# EasyEDA Pro project TRV-Controller.epro, board TRVC_v1.1
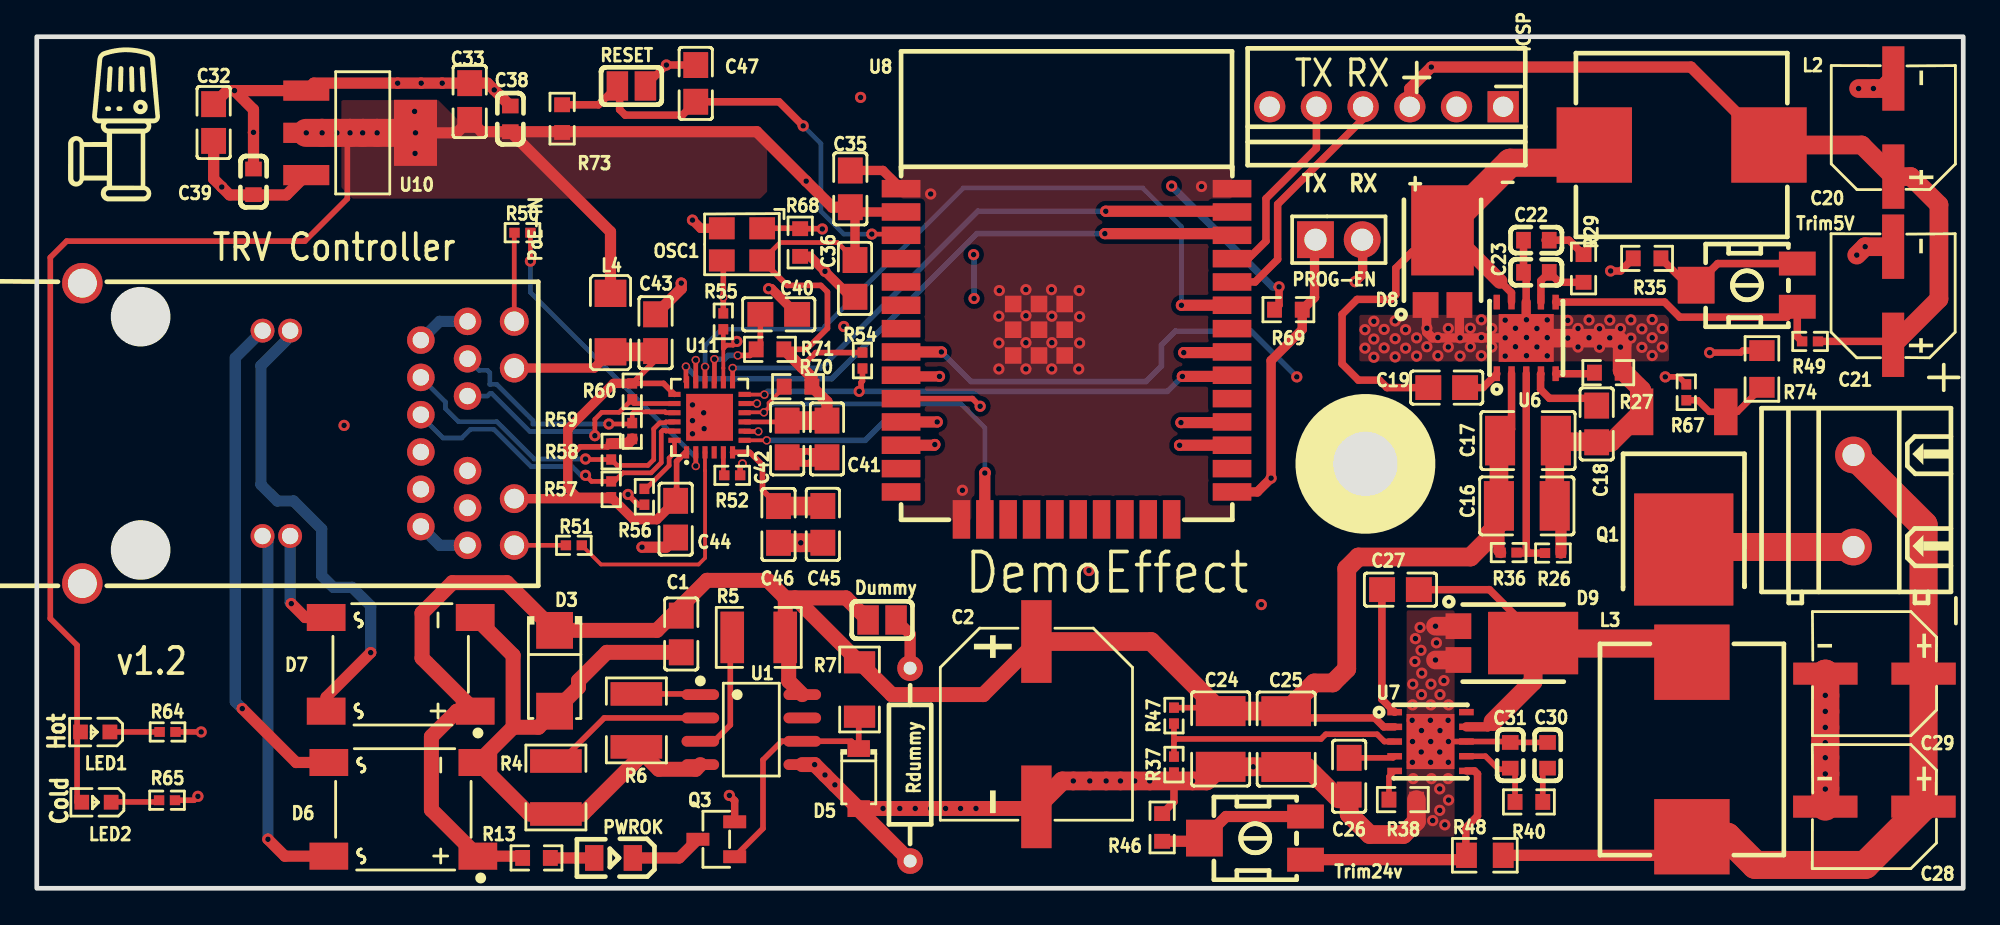
[diagram p3: board, top side]
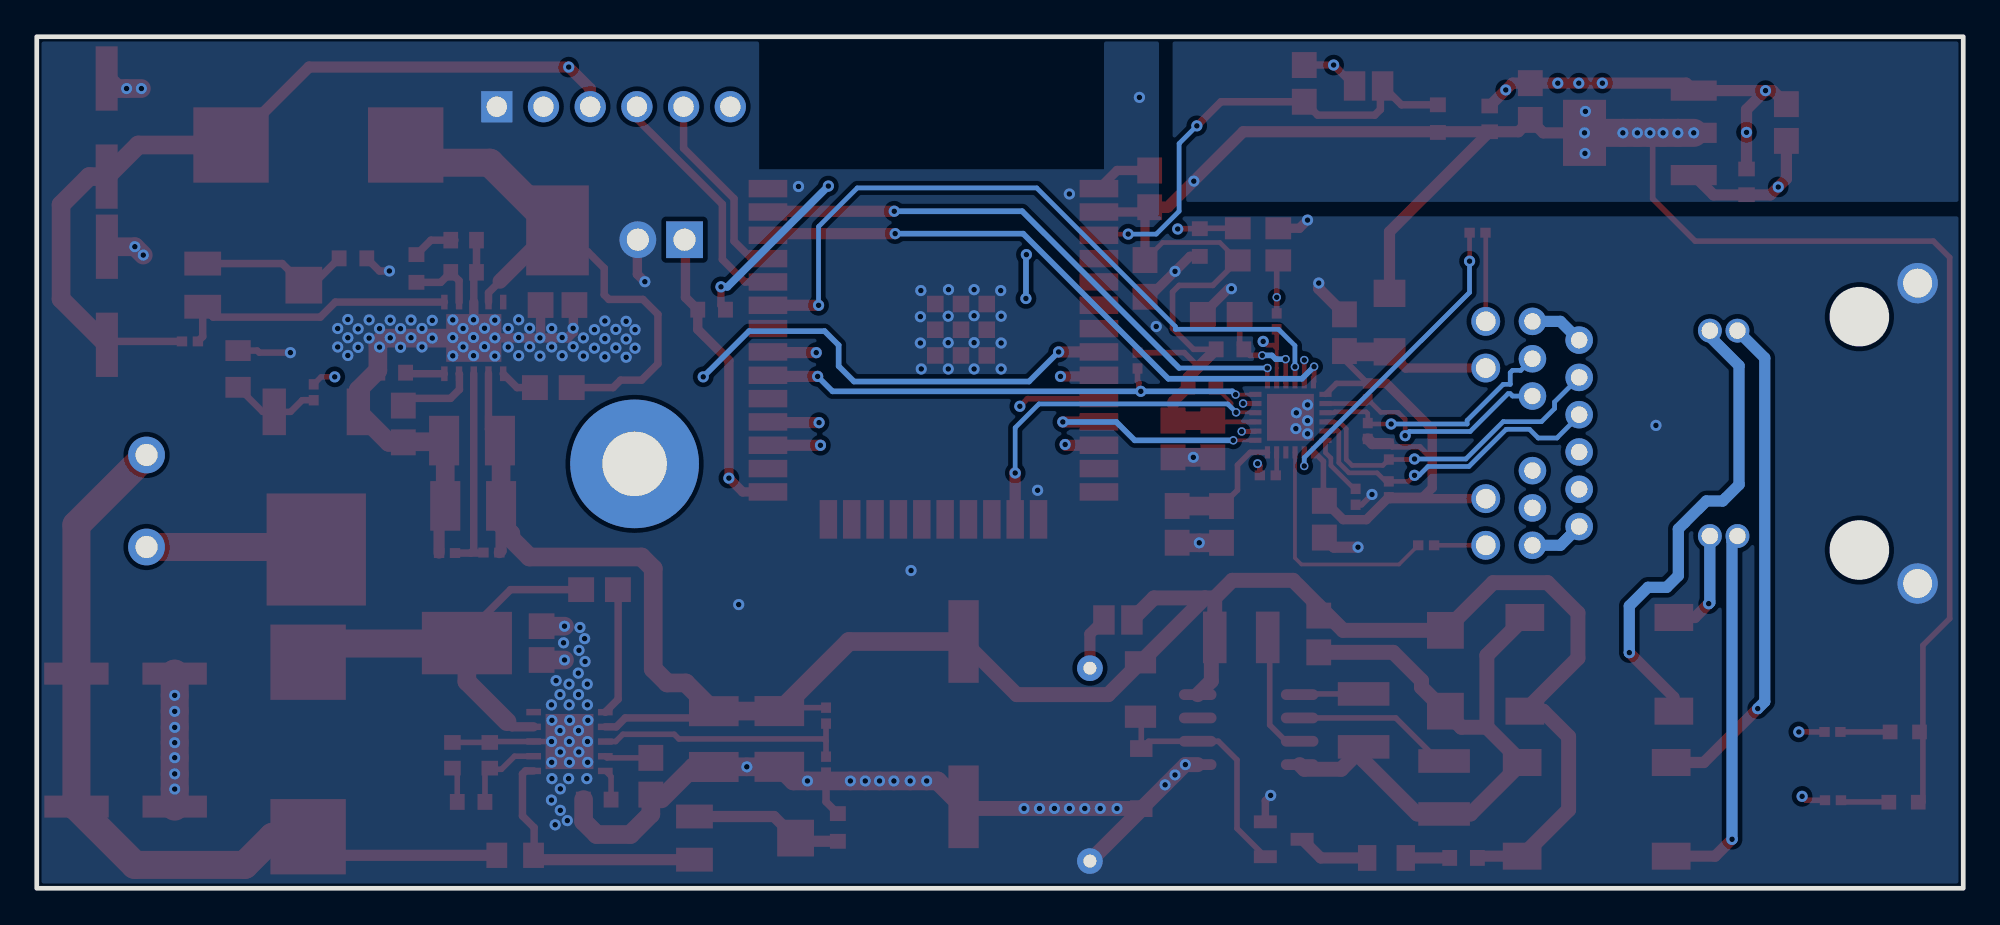
[diagram p4: board, bottom side, seen from below]

Outline 104.78 x 46.36 mm; copper layers: Top Layer, PSUGND, Inner2, Bottom Layer. Coordinates in mm from the lower left corner of the outline.
Outline path: rectangle 0,46.36 104.78,0
Stack: Top Layer 0.035mm 外层铜厚1oz / Dielectric1 0.2104mm 7628 RC49% 8.6mil / PSUGND 0.0152mm 内层铜厚 / Dielectric2 1.065mm 1.1mm H/HOZ 含铜 / Inner2 0.0152mm 内层铜厚 / Dielectric3 0.2104mm 7628 RC49% 8.6mil / Bottom Layer 0.035mm 外层铜厚1oz

## Design rules (mm)
net ETH2X_RX+: DP2
net ETH2X_RX-: DP2
net ETH2X_TX-: DP1
net ETH2X_TX+: DP1
template: Custom Config
spacing copperThickness1oz (default): track to track 0.102, other pairs 0.152 to 0.3
spacing copperThickness2oz: track to track 0.203, other pairs 0.152 to 0.3
spacing copperThicknessInner0.5oz: track to track 0.089, other pairs 0.152 to 0.3
track width copperThickness1oz (default): min 0.102, default 0.254, max 2.54
track width copperThickness2oz: min 0.203, default 0.254, max 2.54
track width copperThickness0.5oz: min 0.089, default 0.254, max 2.54
differential pair differentialPair (default): width min 0.127, default 0.254, max 2.54; gap min 0.152, default 0.152
via viaSize (default): diameter min 0.457, default 0.61, max 10; hole min 0.305, default 0.305, max 6.3

## Placement (name value [footprint] x y rotation side)
C1  100nF  [C0805]  35.05 13.84 90 top
C2  33uF  [CAP-SMD_BD10.0-L10.3-W10.3-LS11.3-FD]  54.37 8.93 270 top
C16  2.2uF  [C1210]  81.04 20.81 180 top
C17  2.2uF  [C1210]  81.1 24.37 180 top
C18  10nF  [C0805]  84.84 25.28 90 top
C19  100nF  [C0805]  76.68 27.25 0 top
C20  47uF  [CAP-SMD_BD6.3-L6.6-W6.6-LS7.6-FD]  100.97 41.41 90 top
C21  47uF  [CAP-SMD_BD6.3-L6.6-W6.6-LS7.6-FD]  100.96 32.25 90 top
C22  68nF  [C0603]  81.56 35.28 0 top
C23  39pF  [C0603]  81.56 33.53 0 top
C24  2.2uF  [C1210]  64.39 8.13 90 top
C25  2.2uF  [C1210]  67.95 8.12 90 top
C26  10nF  [C0805]  71.38 6.1 90 top
C27  100nF  [C0805]  74.17 16.26 180 top
C28  47uF  [CAP-SMD_BD6.3-L6.6-W6.6-LS7.6-FD]  99.94 4.44 180 top
C29  47uF  [CAP-SMD_BD6.3-L6.6-W6.6-LS7.6-FD]  99.95 11.68 180 top
C30  68nF  [C0603]  82.17 7.24 270 top
C31  39pF  [C0603]  80.14 7.24 270 top
C32  100nF  [C0805]  9.62 41.69 270 top
C33  100nF  [C0805]  23.55 42.83 270 top
C35  100nF  [C0805]  44.25 38.07 90 top
C36  22uF  [C0805]  44.5 33.2 270 top
C38  10uF  [C0603]  25.76 41.88 270 top
C39  10uF  [C0603]  11.79 38.46 270 top
C40  100nF  [C0805]  40.35 31.24 180 top
C41  100nF  [C0805]  42.98 24.46 90 top
C42  10uF  [C0805]  40.81 24.46 90 top
C43  100nF  [C0805]  33.65 30.24 90 top
C44  10uF  [C0805]  34.75 20.09 270 top
C45  1uF  [C0805]  42.75 19.81 90 top
C46  470pF  [C0805]  40.34 19.81 90 top
C47  100nF  [C0805]  35.84 43.81 270 top
D3  SMAJ58A-E3/61  [SMA_L4.3-W2.6-LS5.1-RD]  28.16 11.84 270 top
D5  MM1W18  [SOD-123_L2.7-W1.6-LS3.7-RD]  44.7 5.97 270 top
D6  MSB30M  [DIO-BG-SMD_UMSB]  19.94 4.3 180 top
D7  MSB30M  [DIO-BG-SMD_UMSB]  19.79 12.19 180 top
D8  PDS560Q-13  [POWERDI-5_L5.4-W4.0-LS6.5-RD]  76.45 33.78 270 top
D9  PDS560Q-13  [POWERDI-5_L5.4-W4.0-LS6.5-RD]  79.35 13.35 180 top
Dummy  -  [SOLDERJUMPER_REFLOW_NOPASTE]  45.97 14.61 180 top
H1  -  [HOLE_D3M5_D7M0_PAD_PTH]  72.26 23.1 0 top
ICSP  22232061  [CONN-TH_6P-P2.54_22232061]  73.41 42.55 180 top
L2  33uH  [IND-SMD_L11.5-W10.0_FXL1040]  89.46 40.46 0 top
L3  33uH  [IND-SMD_L11.5-W10.0_FXL1040]  90.02 7.56 270 top
L4  CBG321609U121T  [L1206]  31.2 30.79 90 top
LED1  KT-0603R  [LED0603-RD]  3.18 8.51 180 top
LED2  KT-0603B  [LED0603-RD]  3.25 4.68 180 top
OSC1  50MHz  [OSC-SMD_4P-L3.2-W2.5-BL]  38.35 35.05 180 top
P1  WJ128V-5.0-2P  [CONN-TH_2P-P5.00_WJ128V-5.0-2P]  98.81 21.08 90 top
PoE-IN  RT5-ZZ-0030  [RJ45-TH_RT5-ZZ-0030]  14.22 24.77 270 top
PROG-EN  PZ254V-11-02P  [HDR-TH_2P-P2.54-V-M]  70.81 35.31 0 top
PWROK  KT-0805G  [LED0805-R-RD]  31.37 1.65 180 top
Q1  IRLR2905TRPBF  [TO-252-3_L6.5-W5.8-P4.58-BL]  89.57 22.19 180 top
Q3  2N7002  [SOT-23-3_L2.9-W1.3-P1.90-LS2.4-BR]  36.96 2.67 0 top
R4  255Ω  [R1210]  28.23 5.49 90 top
R5  24.9kΩ  [R1210]  39.27 13.66 0 top
R6  178kΩ  [R1210]  32.61 9.14 90 top
R7  100kΩ  [R1206]  44.75 10.82 90 top
R13  30kΩ  [R0603]  27.18 1.65 180 top
R26  90.9kΩ  [R0402]  82.46 18.25 180 top
R27  162kΩ  [R0603]  85.47 28.07 180 top
R29  13kΩ  [R0603]  84.12 33.74 270 top
R35  10kΩ  [R0603]  87.58 34.29 0 top
R36  442kΩ  [R0402]  80.05 18.27 180 top
R37  90.9kΩ  [R0402]  61.85 6.73 90 top
R38  162kΩ  [R0603]  74.29 4.83 180 top
R40  13kΩ  [R0603]  81.15 4.7 180 top
R46  10kΩ  [R0603]  61.21 3.31 270 top
R47  442kΩ  [R0402]  61.85 9.4 90 top
R48  287kΩ  [R0805]  78.76 1.79 0 top
R49  51kΩ  [R0402]  96.44 29.77 0 top
R50  1kΩ  [R0402]  26.42 35.69 0 top
R51  1kΩ  [R0402]  29.21 18.67 0 top
R52  33Ω  [R0402]  37.82 22.48 180 top
R54  1.5kΩ  [R0402]  44.91 28.73 270 top
R55  33Ω  [R0402]  37.34 30.86 90 top
R56  12.1kΩ  [R0402]  33.05 21.31 270 top
R57  49.9Ω  [R0402]  31.24 21.72 270 top
R58  49.9Ω  [R0402]  31.24 23.77 90 top
R59  49.9Ω  [R0402]  32.38 24.89 270 top
R60  49.9Ω  [R0402]  32.38 27.05 90 top
R64  1kΩ  [R0402]  7.11 8.51 0 top
R65  1kΩ  [R0402]  7.08 4.79 0 top
R67  1kΩ  [R0402]  89.71 27 270 top
R68  10kΩ  [R0603]  41.52 35.15 90 top
R69  10kΩ  [R0603]  68.07 31.5 180 top
R70  10kΩ  [R0603]  41.4 27.31 0 top
R71  10kΩ  [R0603]  39.88 29.34 0 top
R73  10kΩ  [R0603]  28.57 41.9 90 top
R74  47kΩ  [R0805]  93.83 28.27 270 top
Rdummy  1kΩ  [RES-TH_BD2.3-L6.5-P10.50-D0.5]  47.5 6.73 90 top
RESET  -  [SOLDERJUMPER_REFLOW_NOPASTE]  32.34 43.67 0 top
Trim5V  5kΩ  [RES-ADJ-SMD_3P-L4.5-W4.5-P2.35-BR]  93 32.83 90 top
Trim24v  5kΩ  [RES-ADJ-SMD_3P-L4.5-W4.5-P2.35-BR]  66.25 2.73 90 top
U1  TPS2375DR  [SOIC-8_L4.9-W3.9-P1.27-LS6.0-BL]  38.86 8.64 270 top
U6  TPS54361QDPRTQ1  [WSON-10_L4.0-W4.0-P0.80-TL-EP]  81.01 29.96 90 top
U7  TPS54361QDPRTQ1  [WSON-10_L4.0-W4.0-P0.80-TL-EP]  75.8 7.99 0 top
U8  ESP32-WROOM-32E-N4  [WIFI-SMD_ESP32-WROOM-32E]  56.01 29.08 270 top
U10  AMS1117-3.3  [SOT-223-3_L6.5-W3.4-P2.30-LS7.0-BR]  17.63 41.12 180 top
U11  LAN8720A-CP-TR  [QFN-24_L4.0-W4.0-P0.50-BL-EP2.6]  36.59 25.64 0 top

## Footprints (pads in the part's own frame, mm; a bottom-side part is the same pattern mirrored in y, then rotated)
C0603
  rect 0.8x0.9 smd: 1(-0.7,0) 2(0.7,0)
C0805
  rect 1.41x1.35 smd: 1(-1,0) 2(1,0)
C1210
  rect 1.635x2.7 smd: 1(-1.518,0) 2(1.518,0)
CAP-SMD_BD6.3-L6.6-W6.6-LS7.6-FD
  rect 3.5x1.2 smd: 1(-2.67,0) 2(2.67,0)
CAP-SMD_BD10.0-L10.3-W10.3-LS11.3-FD
  rect 4.5x1.65 smd: 1(-4.5,0) 2(4.5,0)
CONN-TH_2P-P5.00_WJ128V-5.0-2P
  round 2 hole 1.2: 1(-2.505,0) 2(2.505,0)
CONN-TH_6P-P2.54_22232061
  rect 1.7x1.7 hole 1.1: 1(-6.35,0)
  round 1.7 hole 1.1: 2(-3.81,0) 3(-1.27,0) 4(1.27,0) 5(3.81,0) 6(6.35,0)
DIO-BG-SMD_UMSB
  rect 2.105x1.47 smd: 1(-4.053,2.55) 2(-4.053,-2.55) 3(4.053,-2.55) 4(4.053,2.55)
HDR-TH_2P-P2.54-V-M
  rect 2x2 hole 1.2: 1(-1.27,0)
  round 2 hole 1.2: 2(1.27,0)
HOLE_D3M5_D7M0_PAD_PTH
  round 7 hole 3.5: 1(0,0)
IND-SMD_L11.5-W10.0_FXL1040
  rect 4.1x4.1 smd: 1(-4.75,0) 2(4.75,0)
L1206
  rect 1.485x1.728 smd: 1(-1.593,0) 2(1.593,0)
LED0603-RD
  rect 0.8x0.8 smd: 1(-0.799,0) 2(0.799,0)
LED0805-R-RD
  rect 1x1.399 smd: 1(1.05,0) 2(-1.05,0)
OSC-SMD_4P-L3.2-W2.5-BL
  rect 1.4x1.2 smd: 1(-1.1,-0.875) 2(1.1,-0.875) 3(1.1,0.875) 4(-1.1,0.875)
POWERDI-5_L5.4-W4.0-LS6.5-RD
  rect 1.4x1.4 smd: 1(2.032,-0.92) 2(2.032,0.92)
  rect 4.9x3.4 smd: 3(-2.032,0)
QFN-24_L4.0-W4.0-P0.50-BL-EP2.6
  rect 0.28x0.665 smd: 1(-1.25,-1.907) 2(-0.75,-1.907) 3(-0.25,-1.907) 4(0.25,-1.907) 5(0.75,-1.907) 6(1.25,-1.907) 13(1.25,1.907) 14(0.75,1.907) 15(0.25,1.907) 16(-0.25,1.907) 17(-0.75,1.907) 18(-1.25,1.907)
  rect 0.665x0.28 smd: 7(1.907,-1.25) 8(1.907,-0.75) 9(1.907,-0.25) 10(1.907,0.25) 11(1.907,0.75) 12(1.907,1.25) 19(-1.907,1.25) 20(-1.907,0.75) 21(-1.907,0.25) 22(-1.907,-0.25) 23(-1.907,-0.75) 24(-1.907,-1.25)
  rect 2.55x2.55 smd: 25(0,0)
R0402
  rect 0.566x0.54 smd: 1(-0.433,0) 2(0.433,0)
R0603
  rect 0.806x0.864 smd: 1(-0.753,0) 2(0.753,0)
R0805
  rect 1.133x1.377 smd: 1(-1,0) 2(1,0)
R1206
  rect 1.208x1.701 smd: 1(-1.479,0) 2(1.479,0)
R1210
  rect 1.282x2.808 smd: 1(-1.441,0) 2(1.441,0)
RES-ADJ-SMD_3P-L4.5-W4.5-P2.35-BR
  rect 1.3x2 smd: 1(1.175,-2.75) 3(-1.175,-2.75)
  rect 2x2 smd: 2(0,2.75)
RES-TH_BD2.3-L6.5-P10.50-D0.5
  round 1.4 hole 0.7: 1(-5.25,0) 2(5.25,0)
RJ45-TH_RT5-ZZ-0030
  round 2.2 hole 1.57: 0(-8.175,-11.745) 0(8.175,-11.745)
  round 1.57 hole 1.07: L1(6.095,11.745) L2(3.555,11.745) L3(-3.555,11.745) L4(-6.095,11.745)
  round 1.5 hole 0.89: R1(5.075,6.665) R2(3.045,6.665) R3(1.015,6.665) R4(-1.015,6.665) R5(-3.045,6.665) R6(-5.075,6.665) R7(6.095,9.205) R8(4.06,9.205) R9(2.03,9.205) R10(-2.03,9.205) R11(-4.06,9.205) R12(-6.095,9.205)
  round 1.3 hole 0.89: R13(5.59,-0.445) R14(-5.59,-0.445) R15(5.59,-1.945) R16(-5.59,-1.945)
SMA_L4.3-W2.6-LS5.1-RD
  rect 2x2 smd: 1(-2.2,0) 2(2.2,0)
SOD-123_L2.7-W1.6-LS3.7-RD
  rect 0.91x1.22 smd: 1(-1.635,0) 2(1.635,0)
SOIC-8_L4.9-W3.9-P1.27-LS6.0-BL
  oval 0.588x2.045 smd: 1(-1.905,-2.772) 2(-0.635,-2.772) 3(0.635,-2.772) 4(1.905,-2.772) 5(1.905,2.772) 6(0.635,2.772) 7(-0.635,2.772) 8(-1.905,2.772)
SOLDERJUMPER_REFLOW_NOPASTE
  rect 1.169x1.6 smd: 1(-0.762,0) 2(0.762,0)
SOT-23-3_L2.9-W1.3-P1.90-LS2.4-BR
  rect 1.25x0.7 smd: 1(1,-0.95) 2(1,0.95) 3(-1,0)
SOT-223-3_L6.5-W3.4-P2.30-LS7.0-BR
  rect 2.5x1.1 smd: 1(2.97,-2.3) 2(2.97,0) 3(2.97,2.3)
  rect 2.34x3.6 smd: 4(-2.97,0)
TO-252-3_L6.5-W5.8-P4.58-BL
  rect 1.27x2.54 smd: 1(-2.288,-3.747) 3(2.288,-3.745)
  rect 5.4x6.1 smd: 2(-0.002,3.747)
WIFI-SMD_ESP32-WROOM-32E
  rect 0.95x2.1 smd: 1(-9.002,-9) 2(-7.732,-9) 3(-6.463,-9) 4(-5.192,-9) 5(-3.922,-9) 6(-2.652,-9) 7(-1.383,-9) 8(-0.113,-9) 9(1.157,-9) 10(2.428,-9) 11(3.697,-9) 12(4.968,-9) 13(6.237,-9) 14(7.508,-9) 25(7.508,9) 26(6.237,9) 27(4.968,9) 28(3.697,9) 29(2.428,9) 30(1.157,9) 31(-0.113,9) 32(-1.383,9) 33(-2.652,9) 34(-3.922,9) 35(-5.192,9) 36(-6.463,9) 37(-7.732,9) 38(-9.002,9)
  rect 2.1x0.95 smd: 15(9.002,-5.715) 16(9.002,-4.445) 17(9.002,-3.175) 18(9.002,-1.905) 19(9.002,-0.635) 20(9.002,0.635) 21(9.002,1.905) 22(9.002,3.175) 23(9.002,4.445) 24(9.002,5.715)
  rect 0.9x0.9 smd: 39(-2.721,-0.1) 39(-2.721,-1.5) 39(-2.721,-2.9) 39(-1.321,-0.1) 39(-1.321,-1.5) 39(-1.321,-2.9) 39(0.079,-0.1) 39(0.079,-1.5) 39(0.079,-2.9)
WSON-10_L4.0-W4.0-P0.80-TL-EP
  rect 0.8x0.35 smd: 1(-1.952,1.599) 2(-1.948,0.799) 3(-1.952,-0.001) 4(-1.952,-0.801) 5(-1.952,-1.601) 6(1.948,-1.599) 7(1.948,-0.799) 8(1.948,0.001) 9(1.952,0.801) 10(1.948,1.601)
  rect 2.6x3 smd: 11(-0.004,0)

## Nets
As in the schematic.

Pads without a net: H1 1; ICSP 2 6; PoE-IN R2 R3 R8 R9; U1 7; U6 10; U7 10; U8 4 5 6 13 14 17 18 19 20 21 22 23 24 26 29 32; U11 4

## Via types
v1: diameter 0.61, hole 0.305, Top Layer to Bottom Layer, 225 vias
v2: diameter 0.457, hole 0.305, Top Layer to Bottom Layer, 13 vias
v3: diameter 0.482, hole 0.305, Top Layer to Bottom Layer, 1 via

## Routing (per net, layer and track width the routed paths; a pad name or vN(x,y) marks a point on that pad's centre or on a via; arc(x,y) is an arc through that point)
3V3: length 158.5
  Top Layer w0.254: OSC1.4 40.43,35.15 43.54,35.15 C36.1 ; U11.9 40.74,25.39 C42.2
  Top Layer w0.305: R71.2 41.86,29.34 43,30.48 43,32.46 42.65,32.82 40.81,32.82 OSC1.4 ; v1(17.04,41.12) 16.89,40.98 16.89,37.54 14.58,35.23 1.63,35.23 0.74,34.34 0.74,14.68 2.19,13.22 2.19,4.71 2.18,4.7 ; 44.91,29.16 42.37,29.16 41.59,28.38
  Top Layer w0.406: R69.2 67.56,31.74 v1(67.56,32.74)
  Top Layer w0.508: C36.1 44.5,36.82 ; 44.5,36.82 44.51,36.82 U8.2 ; 44.5,36.82 C35.1
  Top Layer w0.61: C35.1 43.27,37.07 v1(41.85,38.49) 39.16,41.18 C38.2 ; v1(20.6,41.12) 22.84,41.12 C33.2 24.19,41.18 C38.2 ; R71.2 41.59,28.38 42.16,27.81 R70.2 42.98,26.48 C41.2 ; C38.2 31.2,35.74 L4.2
  Top Layer w1.016: C42.2 C41.2
  Top Layer w1.524: v1(14.66,41.12) v1(15.52,41.12) v1(16.32,41.12) v1(17.04,41.12) v1(17.72,41.12) v1(18.51,41.12) v1(20.6,41.12)
  Inner2 w0.406: v1(61.72,38.23) 61.19,38.76 48.18,38.76 46.56,37.14 44.81,37.14 43.45,38.49 v1(41.85,38.49)
  Bottom Layer w0.406: v1(61.72,38.23) 67.21,32.74 v1(67.56,32.74)
  vias: v1(20.55,42.29) v1(20.57,40)
+5V: length 127.2
  Top Layer w0.406: R49.2 100.78,29.77 C21.1
  Top Layer w0.61: U10.3 13.58,37.74 11.77,37.74 ; 11.77,37.74 C39.2 ; 11.77,37.74 10.49,37.74 v1(10.06,38.17) 9.62,38.62 C32.2 ; ICSP.3 74.68,43.54 v1(75.84,44.7) 89.97,44.7 L2.2
  Top Layer w1.016: C21.1 103.45,32.08 103.45,37.21 101.92,38.74 C20.1 99.25,40.46 L2.2
  Inner2 w0.61: v1(75.84,44.7) 75.59,44.45 75.59,40.06 72.87,37.34 60.3,37.34 59.69,37.95 49.94,37.95 48.36,36.37 43.69,36.37 42.39,37.67 10.57,37.67 v1(10.06,38.17)
+24V: length 46
  Top Layer w0.61: R48.2 89.01,1.79 L3.2
  Top Layer w1.524: L3.2 91.94,2.81 93.47,1.27 99.44,1.27 C28.1 102.62,4.45 C29.1 102.62,19.77 P1.2
AVDD: length 39.7
  Top Layer w0.305: 34.42,21.37 34.8,21.75 34.8,23.24 35.29,23.73 U11.1 ; 28.88,23.36 29.55,24.03 31.06,24.03 31.24,24.2 ; U11.19 34.09,27.48 R60.2 33.65,28.75 C43.1
  Top Layer w0.508: R57.2 29.39,21.28 28.88,21.79 28.88,24.99 31.37,27.48 R60.2 ; R57.2 31.17,21.21 25.97,21.21 ; R57.2 32.46,20.07 33.72,20.07 C44.1 ; 25.97,28.32 30.32,28.32 L4.1
  Top Layer w0.61: 32.38,24.46 32.13,24.2 31.24,24.2
  Top Layer w1.016: L4.1 33.61,29.2 C43.1
GND: length 36.4
  Top Layer w0.813: C1.1 31,12.84 29.46,11.3 29.46,10.94 D3.2 27.29,8.76 25.91,8.76 ; 25.91,8.76 25.91,12.68 23.84,14.74 ; 25.91,8.76 D6.2 26.79,4.04 R4.1 29.7,4.04 32.61,6.96 R6.1 33.83,6.48 35.84,6.48 U1.4
VCC: length 122.4
  Top Layer w0.305: R47.2 64.2,9.83
  Top Layer w0.406: C25.2 68.32,9.27 72.77,9.27 73.26,8.79 U7.2 ; U6.2 80.21,24.99 C17.2
  Top Layer w0.61: R13.2 26.33,1.75 23.99,1.75 ; R36.2 79.52,18.37 79.52,19.83
  Top Layer w0.813: 23.99,1.75 21.46,4.27 21.46,8.25 22.85,9.64 23.84,9.64 20.95,12.53 20.95,14.99 22.61,16.64 25.57,16.64 D3.1 33.72,14.04 36.45,16.76 39.75,16.76 40.71,15.81 ; 40.71,15.81 41.24,15.81 ; 40.71,15.81 R5.2 ; 41.24,15.81 R7.2 46.5,10.54 51.48,10.54 C2.1 ; 41.24,15.81 44.01,15.81 Dummy.2 ; 40.89,13.46 40.89,11.28 U1.8
  Top Layer w1.016: 67.95,9.65 69.48,11.18 70.49,11.18 71.25,11.94 71.25,17.4 71.88,18.03 77.98,18.03 78.99,19.05 78.99,19.3 79.52,19.83 C16.2 79.52,24.31 C17.2 ; 67.95,9.65 C25.2 ; 67.95,9.65 C24.2 60.6,13.43 C2.1
VDDCR: length 6.9
  Top Layer w0.305: C46.2 39.47,21.67 39.47,23.04 38.78,23.73 U11.6
  Top Layer w1.016: C45.2 42.75,20.81 C46.2
CLK50M: length 13.1
  Top Layer w0.305: v3(38.38,23.11) 38.26,22.99 R52.1 ; R55.2 v2(37.34,32.17) 37.34,34.09 OSC1.3
  Inner2 w0.203: v3(38.38,23.11) 37.54,23.95 37.54,24.92 37.34,25.12 v2(37.34,32.17)
EN: length 25.7
  Top Layer w0.254: v1(45.41,35.61) 46.94,35.61 U8.3
  Top Layer w0.406: v1(41.68,41.5) 40.37,42.81 C47.2 35.11,42.09 32,42.09 31.7,42.39 31.7,43.55 RESET.1 30.56,42.65 R73.2
  Bottom Layer w0.254: v1(45.41,35.61) 43.89,35.61 42.65,36.86 42.65,40.54 v1(41.68,41.5)
ETH2X_LED1: length 2.8
  Top Layer w0.254: 25.97,18.67 28.78,18.67
ETH2X_LED2: length 4.8
  Top Layer w0.254: 25.97,30.86 25.97,35.67 25.98,35.69
ETH2X_RX+: length 17.9
  Top Layer w0.254: U11.23 34.22,24.89 34.18,24.93 34.05,24.93 33.96,24.84 33.96,23.17 33.41,22.61 31.88,22.61 31.41,22.15 R57.1 30.17,22.15 v1(29.84,22.48)
  Bottom Layer w0.254: v1(29.84,22.48) 29.59,22.48 29.11,22.96 26.88,22.96 24.86,24.99 23.59,24.99 23.11,24.51 22.1,24.51 20.89,25.72 20.89,25.78
ETH2X_RX-: length 18
  Top Layer w0.254: U11.22 34.22,25.39 34.18,25.34 33.88,25.34 33.55,25.01 33.55,23.33 33.24,23.02 31.56,23.02 R58.1 29.87,23.34 v1(29.84,23.37)
  Bottom Layer w0.254: 20.89,27.81 22.22,26.47 22.22,26.11 22.94,25.4 25.02,25.4 27.05,23.37 v1(29.84,23.37)
ETH2X_TX+: length 13.8
  Top Layer w0.254: U11.21 34.22,25.89 34.18,25.93 32.47,25.93 32.38,25.84 R59.1 32.33,25.27 v1(31.12,25.27)
  Bottom Layer w0.254: v1(31.12,25.27) 26.98,25.27 26.98,25.47 25.02,27.43 24.64,27.43 24.64,28.07 24.51,28.19 24.06,28.19 PoE-IN.R11
ETH2X_TX-: length 13.8
  Top Layer w0.254: U11.20 32.47,26.39 32.38,26.48 R60.1 31.68,25.91 30.73,25.91 30.35,25.53 v1(30.35,24.64)
  Bottom Layer w0.254: v1(30.35,24.64) 30.12,24.87 26.81,24.87 24.76,26.92 24.64,26.92 24.51,26.8 PoE-IN.R10
FB5V: length 15.7
  Top Layer w0.406: R49.1 95.75,30.03 Trim5V.3 95.18,31.09 89.36,31.09 88.54,31.91 U6.6
FB24V: length 14.2
  Top Layer w0.406: U7.6 78.19,6.39 78.36,6.22 78.36,3.94 77.72,3.3 77.72,1.83 R48.1
  Top Layer w0.61: R48.1 77.52,1.56 Trim24v.3
IO0_RMII_EMAC_REF_CLK: length 63.2
  Top Layer w0.203: U11.14 37.34,28.32 37.34,28.32 37.34,29.38
  Top Layer w0.254: v1(38.07,29.77) 37.87,29.57 37.52,29.57 37.34,29.38 R55.1
  Top Layer w0.508: 68.96,35.31 69.49,34.77 69.49,32.17 R69.1 68.83,30.42 67.13,28.73 v1(67.13,22.33) 66.38,21.58 U8.25
  Inner2 w0.305: v1(38.07,29.77) 44.3,29.77 47.8,33.27 57.63,33.27 61.54,29.36 61.54,27.13 61.77,26.9 65.33,26.9 69.54,31.11 PROG-EN.1
IO1_TXD0: length 10.7
  Top Layer w0.406: ICSP.5 69.6,40.28 66.85,37.54 66.85,35.23 65.9,34.28 U8.35
IO3_RXD0: length 13.2
  Top Layer w0.406: U8.34 66.26,33.01 67.49,34.23 67.49,37.24 72.14,41.88 ICSP.4
IO13_RMII_EMAC_RX_ER: length 20.7
  Top Layer w0.203: U11.10 38.52,25.91 v2(39.55,25.91) 39.8,26.16 39.8,26.42 40.65,27.26 R70.1
  Top Layer w0.61: U8.16 v1(51.56,22.61) 51.59,22.63
  Bottom Layer w0.254: v1(51.56,22.61) 51.56,25.07 50.27,26.36 40,26.36 v2(39.55,25.91)
IO16_OSC_EN: length 33.9
  Top Layer w0.305: OSC1.1 41.5,35.93 R68.2 42.71,35.91 v1(42.72,35.89)
  Top Layer w0.61: U8.27 v1(62.15,24.12)
  Inner2 w0.305: v1(50.95,34.49) 44.12,34.49 v1(42.72,35.89) ; v1(62.15,24.12) 55.44,24.12 51.33,28.22 51.33,31.75 v1(50.98,32.11)
  Bottom Layer w0.305: v1(50.95,34.49) 50.98,34.47 v1(50.98,32.11)
IO17_COLD: length 78.2
  Top Layer w0.305: R65.2 8.55,4.79 v1(8.76,5)
  Top Layer w0.61: U8.28 64.97,25.35 v1(62.23,25.35)
  Inner2 w0.305: v1(62.23,25.35) 62.26,25.32 64.39,25.32 65.89,23.83 65.89,20.24 55.85,10.21 50.57,10.21 42.04,1.68 20.14,1.68 16.81,5 v1(8.76,5)
IO18_RMII_MDIO: length 28.4
  Top Layer w0.203: v2(39.57,26.87) 38.51,26.87 U11.12
  Top Layer w0.305: R54.2 44.91,27.61 44.83,27.53 44.83,27.05 44.73,26.95
  Top Layer w0.61: v1(62.31,27.86) 64.95,27.86 U8.30
  Bottom Layer w0.305: v1(62.31,27.86) 61.49,27.05 v1(44.73,27.05) 39.75,27.05 v2(39.57,26.87)
IO19_RMII_EMAC_TXD0: length 37.6
  Top Layer w0.254: U11.17 35.84,27.55 v2(35.84,28.75)
  Top Layer w0.61: U8.31 64.97,29.16 v1(62.38,29.16)
  Inner2 w0.254: v2(35.84,28.75) 35.84,31.88 36.8,32.84 37.64,32.84 38.3,32.18 38.3,31.72 38.48,31.55 42.7,31.55 44.96,33.81 57.73,33.81 v1(62.38,29.16)
IO21_RMII_EMAC_TX_EN: length 39.4
  Top Layer w0.254: 36.35,28.35 36.34,28.34 U11.16
  Top Layer w0.61: U8.33 v1(62.26,31.74)
  Bottom Layer w0.254: v2(36.35,28.39) 36.35,29.54 37.24,30.43 42.85,30.43 42.85,30.58 50.39,38.13 60.15,38.13 62.26,36.02 v1(62.26,31.74)
IO22_RMII_EMAC_TXD1: length 34.2
  Top Layer w0.254: U11.18 35.31,27.58 v2(35.31,28.4)
  Top Layer w0.305: v2(35.31,28.4) 35.33,28.4
  Top Layer w0.61: v1(58.09,35.64) 64.92,35.64 U8.36
  Bottom Layer w0.305: v1(58.09,35.64) 51.13,35.64 43.23,27.74 35.97,27.74 v2(35.31,28.4)
IO23_RMII_MDC: length 31.5
  Top Layer w0.254: U11.13 37.85,27.55 v2(37.85,28.32)
  Top Layer w0.305: v2(37.85,28.32) 37.87,28.3
  Top Layer w0.61: U8.37 64.97,36.86 v1(58.14,36.86)
  Bottom Layer w0.254: v2(37.85,28.32) 42.65,28.32
  Bottom Layer w0.305: 42.65,28.32 51.18,36.86 v1(58.14,36.86)
IO25_RMII_EMAC_RXD0: length 18.1
  Top Layer w0.254: U11.8 38.52,24.87 v2(39.24,24.87)
  Top Layer w0.305: U8.10 50.89,26.66 v1(51.31,26.24)
  Inner2 w0.305: v2(39.24,24.87) 39.29,24.92 46.89,24.92 48.46,26.49 51.05,26.49 v1(51.31,26.24)
IO26_RMII_EMAC_RXD1: length 12.9
  Top Layer w0.203: U11.7 38.5,24.38 v2(39.7,24.38)
  Top Layer w0.61: U8.11 v1(48.97,25.39)
  Bottom Layer w0.305: v2(39.7,24.38) 45.06,24.38 46.06,25.39 v1(48.97,25.39)
IO27_RMII_EMAC_CRS_DV: length 15.4
  Top Layer w0.254: v2(39.17,26.39) 38.5,26.39 U11.11
  Top Layer w0.61: U8.12 48.8,24.12 v1(48.84,24.16)
  Inner2 w0.254: v2(39.17,26.39) 38.56,25.78 38.56,24.46 39.22,23.8 40.97,23.8 41.25,24.08 48.77,24.08 v1(48.84,24.16)
IO32_CFG: length 46.4
  Top Layer w0.305: v1(88.57,27.84) 89.31,27.84 R67.1
  Top Layer w0.61: U8.8 v1(49.2,29.2)
  Inner2 w0.305: v1(88.57,27.84) v1(68.53,27.84)
  Bottom Layer w0.305: v1(49.2,29.2) 50.81,27.58 60.32,27.58 61.16,28.42 61.16,29.57 61.93,30.33 66.04,30.33 v1(68.53,27.84)
IO33_HOT: length 71.7
  Top Layer w0.305: R64.2 v1(8.94,8.51)
  Top Layer w0.559: v1(49.1,27.86) 47.07,27.86 U8.9
  Inner2 w0.305: v1(49.1,27.86) 50.9,27.86 52.93,25.83 52.93,13.54 41.68,2.29 20.5,2.29 16.99,5.79 11.66,5.79 v1(8.94,8.51)
NRST: length 5.8
  Top Layer w0.254: U11.15 36.86,27.56 v2(36.86,28.8)
  Top Layer w0.305: v2(38.13,29.01) 38.79,29.01 R71.1 39.35,29.57 C40.2
  Bottom Layer w0.305: v2(36.86,28.8) 37.39,28.8 37.6,29.01 v2(38.13,29.01)
OSCIN: length 1.3
  Top Layer w0.254: U11.5 37.34,22.53 R52.2
PSUGND: length 155.6
  Top Layer w0.305: R37.1 61.97,6.18 61.97,5.84 ; C30.1 C31.1 80.09,7.99 U7.8 v1(76.78,7.99) 75.8,7.99 ; R56.2 32.72,20.88 v1(32.16,21.44)
  Top Layer w0.355: v1(90.98,29.16) 92.67,29.16 92.78,29.27 R74.1
  Top Layer w0.406: v1(85.6,33.6) 86.14,33.6 R35.1 ; R46.1 61.85,4.71 61.85,5.84 ; C47.1 v1(34.24,44.81) RESET.2 ; C22.1 C23.1 81.01,33.38 U6.8 ; v1(37.67,5.05) 37.96,4.77 Q3.2
  Top Layer w0.508: 71.5,35.31 72.11,34.7 72.11,33.43 v1(71.7,33.02) ; D8.1 75.59,31.69 75.59,30.28 75.91,29.96 77.39,29.96 ; U6.8 81.01,29.96 77.39,29.96 ; v1(39.8,32.64) 39.96,32.64 C40.1 ; R68.1 42.05,34.4 v1(42.87,33.58) 44.26,32.2 C36.2 ; 77.39,29.96 77.37,29.98 D8.2 ; C35.2 46.02,39.07 U8.1 ; v1(35.66,36.37) 36.11,35.93 OSC1.2
  Top Layer w0.61: v1(10.75,43.42) 11.79,42.39 v1(11.79,41.15) C39.1 ; v1(10.75,43.42) 10.36,43.42 C32.1 ; v1(10.75,43.42) U10.1 15.06,43.83 v1(19.63,43.83) v1(20.91,43.83) v1(22.05,43.83) C33.1 24.51,43.83 v1(24.88,43.46) C38.1 ; v1(35.05,32.94) 35.05,32.64 C43.2 ; C16.1 82.89,20.48 R26.1 ; v1(32.92,18.57) 34.22,18.57 C44.2
  Top Layer w0.813: C2.2 54.28,4.34 v1(51.08,4.34) v1(50.24,4.34) v1(49.43,4.34) v1(48.62,4.34) v1(47.78,4.34) v1(46.94,4.34) v1(46.03,4.34) 44.71,4.34 D5.2 ; D5.2 v1(43.41,5.63) v1(42.87,6.17) v1(42.31,6.73) U1.5 ; D5.2 44.7,4.28 Rdummy.1
  Top Layer w1.016: 77.32,12.43 v1(76.07,12.43) ; 67.95,6.61 v1(66.16,6.61) C24.1 63.62,5.84 v1(62.86,5.84) v1(60.53,5.84) v1(59.72,5.84) v1(58.94,5.84) v1(58.16,5.84) v1(57.27,5.84) v1(56.37,5.84) 55.78,5.84 C2.2 ; 67.95,6.61 C25.1 ; 67.95,6.61 69.06,6.61 70.8,4.87 ; C46.1 v1(41.55,18.81) 42.75,18.81 C45.1 ; C42.1 v1(41.87,23.46) C41.1 ; v1(99.09,43.54) v1(99.89,43.54) 100.43,43.54 C20.2 ; C16.1 82.56,24.31 ; 82.56,24.31 84.81,24.31 C18.1 85.63,24.28 Q1.3 87.28,27.13 86.22,28.19 86.22,29.62 85.9,29.95 81.02,29.95 U6.11 ; 82.56,24.31 C17.1 ; C26.1 71.38,4.04 72.49,2.93 74.32,2.93 75.04,3.64 75.04,4.83 ; v1(98.98,34.47) v1(99.44,34.92) C21.2 ; D9.1 v1(76.07,14.27)
  Top Layer w1.524: 97.27,4.44 v1(97.27,5.4) v1(97.27,6.23) v1(97.27,7.11) v1(97.27,7.92) v1(97.27,8.76) v1(97.27,9.63) v1(97.27,10.5) 97.27,11.68 C29.2
  vias: v1(16.71,25.2) v1(35.66,26.31) v1(35.66,25.45) v1(35.66,24.74) v1(36.27,25.88) v1(36.3,25.02) v1(43.89,30.58) v1(44.81,43.05) v1(48.62,37.8) v1(50.34,21.67) v1(52.35,32.54) v1(52.33,31.14) v1(52.33,29.68) v1(52.33,28.27) v1(53.8,32.59) v1(53.8,31.17) v1(53.8,29.7) v1(53.8,28.27) v1(55.19,32.59) v1(55.21,31.14) v1(55.21,29.7) v1(55.2,28.27) v1(56.69,32.54) v1(56.72,31.11) v1(56.72,29.68) v1(56.67,28.27) v1(57.23,17.3) v1(63.35,38.2) v1(66.6,15.44) v1(72.24,30.41) v1(72.24,29.4) v1(72.72,30.86) v1(72.72,29.9) v1(72.72,28.91) v1(73.28,30.42) v1(73.28,29.42) v1(73.88,30.88) v1(73.88,29.92) v1(73.88,28.93) v1(74.45,30.41) v1(74.45,29.4) v1(74.84,11.11) v1(74.83,9.98) v1(74.8,9.14) v1(74.82,7.99) v1(74.82,6.86) v1(74.86,5.97) v1(75.04,29.96) v1(75.04,28.97) v1(74.98,13.59) v1(74.96,12.34) v1(75.24,14.2) v1(75.29,12.95) v1(75.32,11.71) v1(75.31,10.54) v1(75.31,8.58) v1(75.3,7.42) v1(75.6,30.49) v1(75.6,29.48) v1(75.83,11.11) v1(75.82,9.98) v1(75.79,9.14) v1(75.81,7.99) v1(75.81,6.86) v1(75.85,5.97) v1(75.92,3.68) v1(76.12,13.36) v1(76.2,29.98) v1(76.2,28.99) v1(76.32,10.54) v1(76.32,8.58) v1(76.3,7.42) v1(76.3,5.41) v1(76.3,4.24) v1(76.53,11.3) v1(76.58,3.45) v1(76.77,30.47) v1(76.77,29.47) v1(76.79,9.98) v1(76.76,9.14) v1(76.77,6.86) v1(76.76,5.97) v1(76.78,4.8) v1(77.41,29.96) v1(77.41,28.97) v1(77.97,30.49) v1(77.97,29.48) v1(78.57,30.95) v1(78.57,29.98) v1(78.57,28.99) v1(79.13,30.47) v1(79.13,29.47) v1(79.86,30.93) v1(79.86,29.96) v1(79.86,28.97) v1(80.42,30.49) v1(80.42,29.48) v1(81.02,30.95) v1(81.02,29.98) v1(81.02,28.99) v1(81.59,30.47) v1(81.59,29.47) v1(82.15,30.94) v1(82.15,29.97) v1(82.15,28.98) v1(83.27,30.91) v1(83.27,29.95) v1(83.82,30.47) v1(83.82,29.47) v1(84.42,30.93) v1(84.42,29.97) v1(84.99,30.46) v1(84.99,29.45) v1(85.55,30.93) v1(85.55,29.96) v1(86.13,30.47) v1(86.13,29.46) v1(86.7,30.94) v1(86.7,29.95) v1(87.3,30.45) v1(87.3,29.44) v1(87.86,30.96) v1(87.86,29.97) v1(87.86,29) v1(88.41,30.47) v1(88.41,29.47)
$1N36: length 3.5
  Top Layer w0.305: U1.1 36.05,10.58 32.61,10.58
$1N37: length 6.8
  Top Layer w0.305: U1.3 36.83,8 37.72,8.89 37.72,13.55 R5.1
$1N44: length 2.9
  Top Layer w0.61: Dummy.1 47.5,13.84 Rdummy.2
$1N45: length 2.4
  Top Layer w0.61: R13.1 PWROK.1
$1N46: length 4
  Top Layer w0.61: PWROK.2 34.94,1.65 Q3.3
$1N14640: length 3
  Bottom Layer w0.61: 20.89,19.69 21.91,18.67 PoE-IN.R7
$1N14694: length 3
  Bottom Layer w0.61: 20.89,29.84 21.91,30.86 PoE-IN.R12
$1N15545: length 20.3
  Top Layer w0.61: v1(12.57,2.67) 13.49,1.75 15.89,1.75
  Bottom Layer w0.61: PoE-IN.R15 12.57,18.88 v1(12.57,2.67)
$1N16790: length 27.3
  Top Layer w0.61: D6.3 14.11,6.85 v1(11.18,9.78)
  Bottom Layer w0.61: PoE-IN.R16 10.8,28.87 10.8,10.16 v1(11.18,9.78)
$1N16797: length 5.9
  Top Layer w0.61: D7.3 14.6,14.74 v1(13.84,15.49)
  Bottom Layer w0.61: PoE-IN.R13 13.78,15.56 v1(13.84,15.49)
$1N16804: length 26
  Top Layer w0.61: D7.4 15.74,10.4 v1(18.16,12.83)
  Bottom Layer w0.61: v1(18.16,12.83) 18.16,15.37 17.14,16.38 16.13,16.38 15.49,17.02 15.49,19.56 13.97,21.08 13.08,21.08 12.19,21.97 12.19,28.45 13.78,30.03 PoE-IN.R14
$1N21745: length 13.5
  Top Layer w0.305: R7.1 44.7,9.3 D5.1 44.31,8 U1.6 40.51,8 39.5,6.98 39.5,3.26 Q3.1
$1N28176: length 8.8
  Top Layer w0.305: U1.2 30.86,9.27 28.52,6.93 R4.2
$2N1122: length 4.3
  Top Layer w0.406: U6.4 81.79,27.99 81.79,27.15 82.27,26.67 84.44,26.67 C18.2
$2N1124: length 3.9
  Top Layer w0.406: U6.7 81.81,33.07 C23.2 82.8,32.99 R29.2
$2N1126: length 2.4
  Top Layer w0.406: 82.03,35.28 83.34,35.28 84.12,34.49
$2N1129: length 2
  Top Layer w0.406: C19.2 78.65,27.25 U6.1
$2N1134: length 11.4
  Top Layer w0.406: U6.3 81.01,18.42 81.18,18.25 ; R36.1 80.51,18.25 81.18,18.25 ; 81.18,18.25 R26.2
$2N1135: length 2.2
  Top Layer w0.406: 84.72,28.19 84.53,28.01 U6.5
$2N1138: length 32
  Top Layer w0.406: U6.9 80.21,32.42 79.58,33.05 ; D8.3 75.29,34.65 74.8,34.65 73.91,33.76 73.91,32.31 73.66,32.06 71.81,32.06 70.99,31.24 70.99,28.55 71.88,27.66 73.03,27.66 73.43,27.25 C19.1
  Top Layer w0.813: 79.58,33.05 76.81,35.81 D8.3
  Top Layer w1.524: D8.3 80.14,39.5 83.74,39.5 L2.1
$2N1149: length 8.5
  Top Layer w0.406: R35.2 89.79,32.83 Trim5V.2 91.43,34.01 95.75,34.01
$2N2248: length 2.5
  Top Layer w0.305: C26.2 73.76,7.1 U7.4
$2N2250: length 4.7
  Top Layer w0.305: U7.7 78.79,7.19 79.5,6.48 80.07,6.48 C31.2 80.4,6.28 R40.2
$2N2252: length 1.9
  Top Layer w0.305: R40.1 81.91,6.28 C30.2
$2N2255: length 7
  Top Layer w0.406: U7.1 73.85,9.59 73.16,10.29 73.16,16.25 C27.2
$2N2260: length 14.1
  Top Layer w0.305: R47.1 61.85,8.01 ; 61.85,8.01 61.97,8.13 69.85,8.13 70.1,8.38 72.9,8.38 73.29,7.99 U7.3 ; 61.85,8.01 R37.2
$2N2261: length 1.7
  Top Layer w0.305: R38.2 73.54,6.08 U7.5
$2N2264: length 23.2
  Top Layer w0.406: C27.1 79.01,16.26 81.94,13.32
  Top Layer w0.508: U7.9 78.92,8.79 79.2,9.07
  Top Layer w1.016: 79.2,9.07 81.38,11.25 D9.3
  Top Layer w1.524: 81.94,13.32 89,13.32 L3.1
$2N2275: length 8.4
  Top Layer w0.61: Trim24v.1 64.68,3.91 Trim24v.2 63.33,2.56 61.21,2.56
$3N1808: length 17.2
  Top Layer w0.254: R50.2 v1(26.85,34.14) ; U11.2 v2(35.84,22.99)
  Bottom Layer w0.254: v2(35.84,22.99) 35.84,23.44 26.85,32.44 v1(26.85,34.14)
$3N1811: length 13
  Top Layer w0.203: U11.3 36.34,22.74 36.35,22.73 36.35,17.98 35.99,17.63 30.68,17.63 R51.2
  Top Layer w0.254: 36.35,23.72 U11.3
$3N1874: length 3.4
  Top Layer w0.254: U11.24 34.68,23.71 34.39,23.42 34.39,23.01 33.12,21.74 R56.1
$3N4256: length 2.4
  Top Layer w0.305: 4.29,8.51 6.68,8.51
$3N4295: length 2.4
  Top Layer w0.305: 4.28,4.7 6.56,4.7 R65.1
$3N6030: length 9.3
  Top Layer w1.524: P1.1 89.71,18.58 Q1.2
$3N10808: length 4.9
  Top Layer w0.355: R67.2 90.34,26.57 90.97,25.94 Q1.1 92.49,25.94 R74.2

## Copper pours and planes (outline as drawn; the poured copper is in the pictures)
3V3 on Top Layer: 16.56,42.9 16.56,38.15 17.17,37.54 39.34,37.54 39.73,37.92 39.73,40.92 39.16,41.49 23.25,41.49 21.84,42.9
3V3 on Bottom Layer: 0,46.36 43,46.36 43,37.36 0,37.36
PSUGND on Top Layer: 74.5,15.13 77.11,15.13 77.11,2.81 74.5,2.81
PSUGND on Top Layer: 71.93,31.22 88.77,31.22 88.77,28.68 71.93,28.68
PSUGND on Top Layer: 47.01,39.28 65.01,39.28 65.01,20.06 47.01,20.06
PSUGND on Bottom Layer: 0.08,-0.13 104.8,-0.13 104.83,-0.15 104.83,46.2 104.85,46.23 43.76,46.23 43.74,46.2 43.74,36.65 43.81,36.58 0.08,36.58
PSUGND on PSUGND: 0.26,46.1 104.52,46.1 104.52,0.26 0.26,0.26
PSUGND on Inner2: -0.31,46.58 104.47,46.58 104.47,0.23 -0.31,0.23

Small or netless copper shapes (teardrops, artwork), in the pictures only: 19 on PSUGND

## Text on the board
Top Silkscreen Layer: TX | RX | + | - | Hot | Cold | v1.2 | TRV Controller | DemoEffect
